# EAGLE design KirmesKontroller (EAGLE 9.6.2)
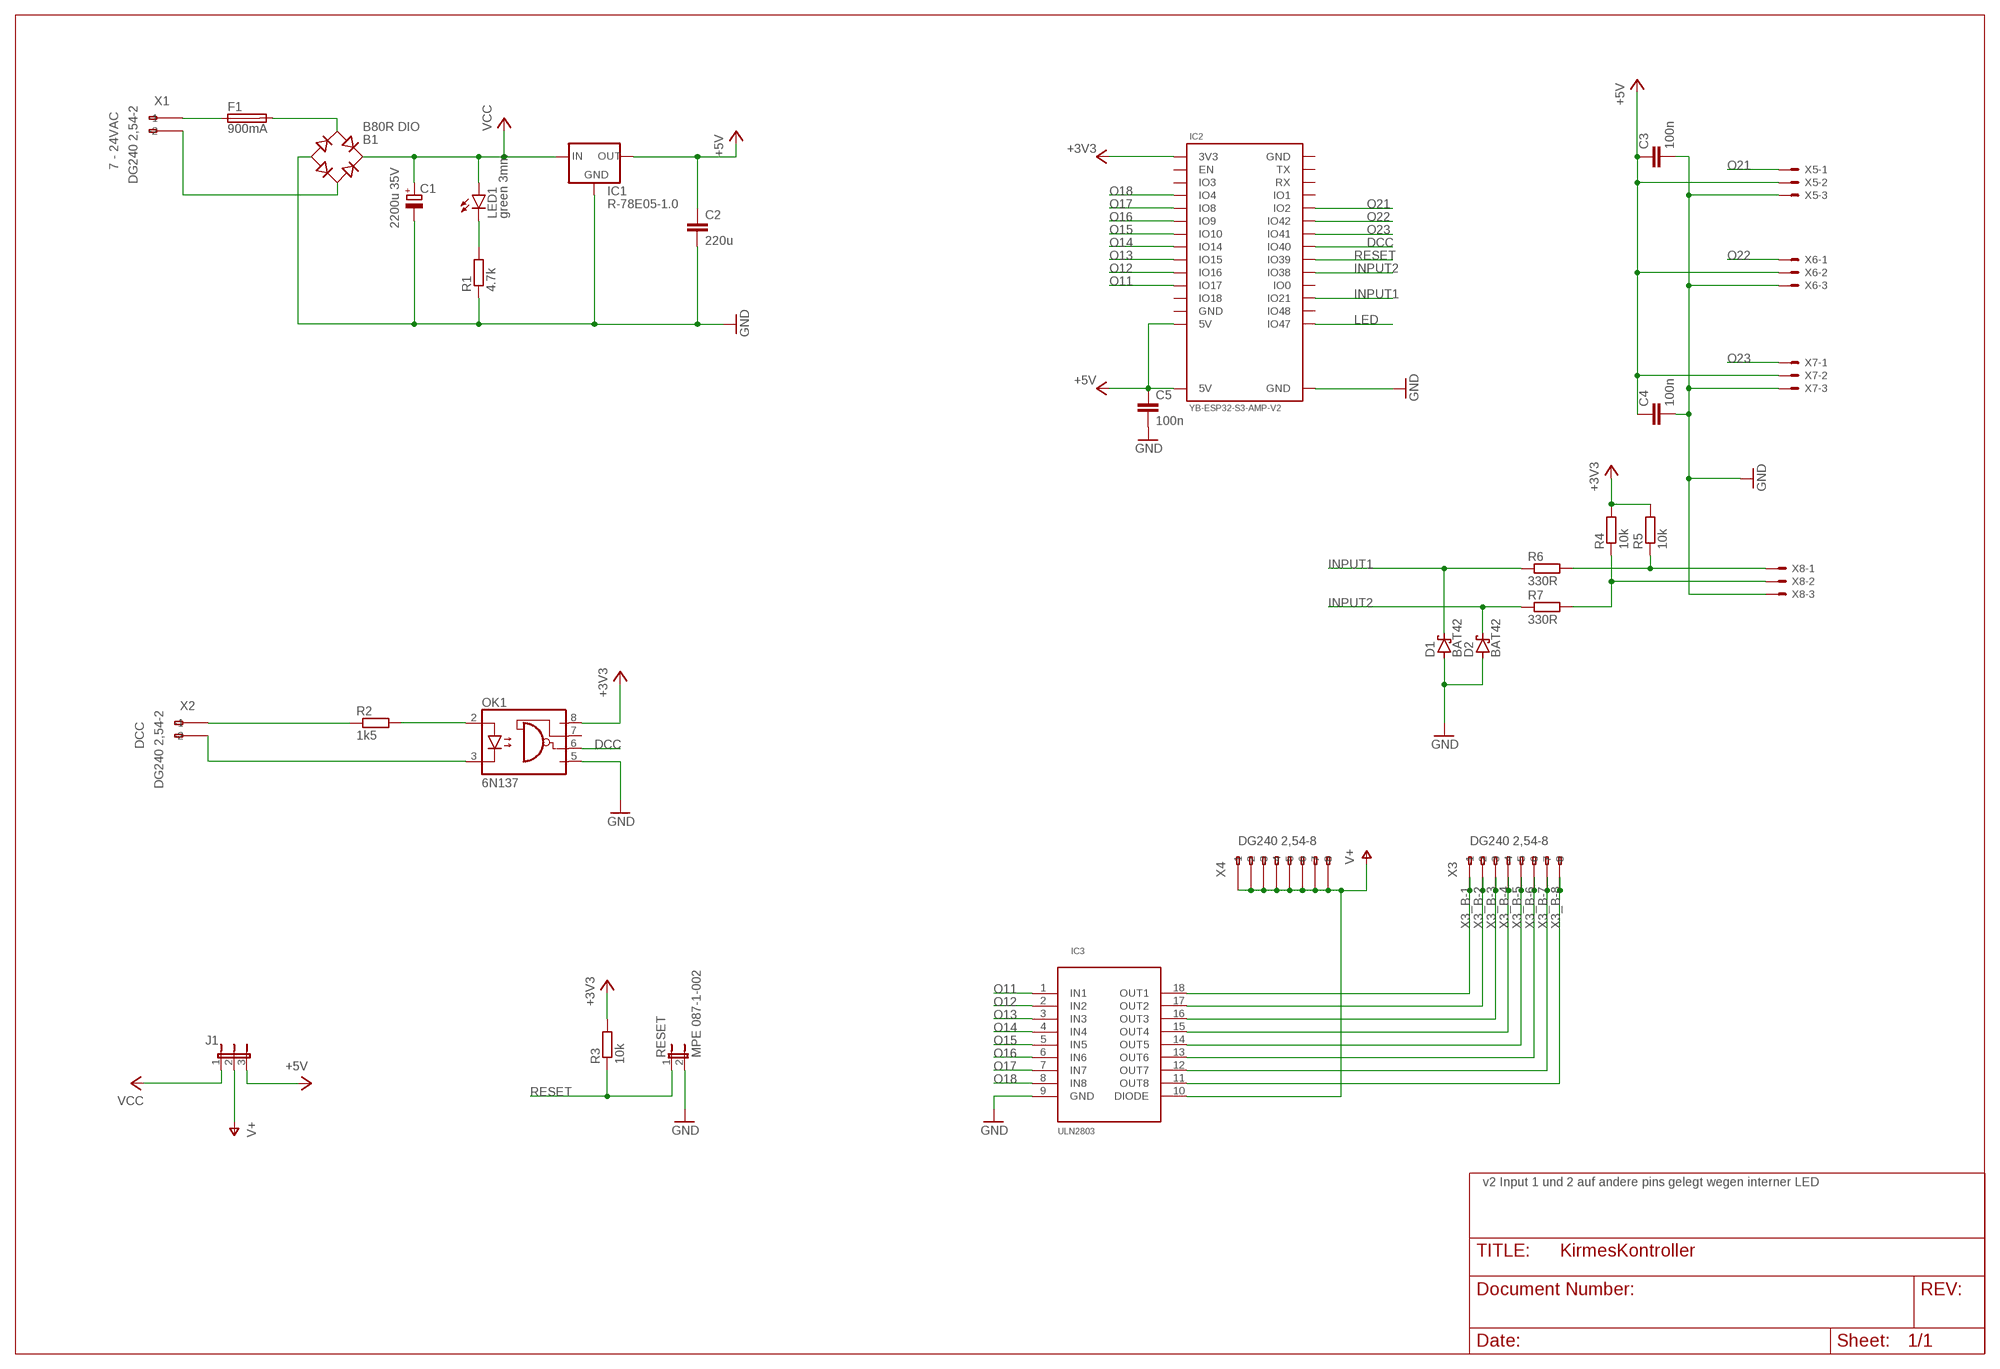
[diagram p0: schematic, sheet 1]

## Parts
B1  B80R DIO  RB1A  [RB1A]
C1  2200u 35V  CPOL-EUE5-8.5  [E5-8,5]
C2  220u  C-EU050-024X044  [C050-024X044]
C3  100n  C-EU050-024X044  [C050-024X044]
C4  100n  C-EU050-024X044  [C050-024X044]
C5  100n  C-EU050-024X044  [C050-024X044]
D1  BAT42  [DO35-10]
D2  BAT42  [DO35-10]
F1  900mA  TE5  [TE5]
IC1  R-78E05-1.0  R-78E-XX1.0  [R-78E-XX1.0]
IC2  YB-ESP32-S3-AMP-V2  [YB-ESP32-S3-AMP]
IC3  ULN2803  ULN2803DIL18  [DIL18]
J1  MPE 087-1-003  JP2E  [JP2]
LED1  green 3mm  TLLG4400  [LED3MM]
OK1  6N137  [DIL08]
R1  4.7k  R-EU_0207/10  [0207/10]
R2  1k5  R-EU_0207/10  [0207/10]
R3  10k  R-EU_0207/10  [0207/10]
R4  10k  R-EU_0207/10  [0207/10]
R5  10k  R-EU_0207/10  [0207/10]
R6  330R  R-EU_0207/10  [0207/10]
R7  330R  R-EU_0207/10  [0207/10]
RESET  MPE 087-1-002  JP1E  [JP1]
X1  DG240 2,54-2  233-202  [233-202]
X2  DG240 2,54-2  233-202  [233-202]
X3  DG240 2,54-8  233-508  [233-508]
X4  DG240 2,54-8  233-508  [233-508]
X5  22-23-2031  [22-23-2031]
X6  22-23-2031  [22-23-2031]
X7  22-23-2031  [22-23-2031]
X8  22-23-2031  [22-23-2031]

## Nets
+3V3: IC2.3V3 OK1.8(VCC) R3.2 R4.2 R5.2
+5V: C2.1 C3.1 C4.1 C5.1 IC1.OUT IC2.5V IC2.5V@1(5V) J1.3 X5.2 X6.2 X7.2
DCC: IC2.40(IO40) OK1.6(VO)
GND: B1.- C1.- C2.2 C3.2 C4.2 C5.2 D1.A D2.A IC1.GND IC2.GND IC3.9(GND) OK1.5(GND) R1.1 RESET.2 X5.3 X6.3 X7.3 X8.3
INPUT1: D1.C IC2.21(IO21) R6.1
INPUT2: D2.C IC2.38(IO38) R7.1
LED: IC2.47(IO47)
N$1: R5.1 R6.2 X8.1
N$2: R4.1 R7.2 X8.2
N$3: LED1.K(C) R1.2
N$5: B1.AC1 F1.2
N$6: B1.AC2 X1.A2(-2)
N$9: R2.1 X2.A1(-1)
N$10: OK1.2(A) R2.2
N$11: OK1.3(C) X2.A2(-2)
N$15: F1.1 X1.A1(-1)
O11: IC2.17(IO17) IC3.1(IN1)
O12: IC2.16(IO16) IC3.2(IN2)
O13: IC2.15(IO15) IC3.3(IN3)
O14: IC2.14(IO14) IC3.4(IN4)
O15: IC2.10(IO10) IC3.5(IN5)
O16: IC2.9(IO9) IC3.6(IN6)
O17: IC2.8(IO8) IC3.7(IN7)
O18: IC2.4(IO4) IC3.8(IN8)
O21: IC2.2(IO2) X5.1
O22: IC2.42(IO42) X6.1
O23: IC2.41(IO41) X7.1
RESET: IC2.39(IO39) R3.1 RESET.1
V+: IC3.10(DIODE) J1.2 X4.A1(-1) X4.A2(-2) X4.A3(-3) X4.A4(-4) X4.A5(-5) X4.A6(-6) X4.A7(-7) X4.A8(-8)
VCC: B1.+ C1.+ IC1.IN J1.1 LED1.A
X3_B-1: IC3.18(OUT1) X3.A1(-1) X3.B1(B-1)
X3_B-2: IC3.17(OUT2) X3.A2(-2) X3.B2(B-2)
X3_B-3: IC3.16(OUT3) X3.A3(-3) X3.B3(B-3)
X3_B-4: IC3.15(OUT4) X3.A4(-4) X3.B4(B-4)
X3_B-5: IC3.14(OUT5) X3.A5(-5) X3.B5(B-5)
X3_B-6: IC3.13(OUT6) X3.A6(-6) X3.B6(B-6)
X3_B-7: IC3.12(OUT7) X3.A7(-7) X3.B7(B-7)
X3_B-8: IC3.11(OUT8) X3.A8(-8) X3.B8(B-8)
Unconnected: IC2.0(IO0) IC2.1(IO1) IC2.3(IO3) IC2.18(IO18) IC2.48(IO48) IC2.EN IC2.RX IC2.TX OK1.7(VE) X1.B1(B-1) X1.B2(B-2) X2.B1(B-1) X2.B2(B-2) X4.B1(B-1) X4.B2(B-2) X4.B3(B-3) X4.B4(B-4) X4.B5(B-5) X4.B6(B-6) X4.B7(B-7) X4.B8(B-8)

## Notes on the sheet
- 7 - 24VAC
- DCC
- v2 Input 1 und 2 auf andere pins gelegt wegen interner LED

## Power pins joined to a net without a drawn wire
GND: IC2.GND@1(GND) IC2.GND@2(GND)

## Library data of the parts
B1 = rectifier:RB1A: RECTIFIER 1 A
C1 = rcl:CPOL-EU: POLARIZED CAPACITOR, European symbol; SPICEPREFIX: C
C2-C5 = rcl:C-EU: CAPACITOR, European symbol; SPICEPREFIX: C
D1 D2 = diode:BAT42: DIODE barrier diode
F1 = fuse:TE5: FUSE Wickmann; OC_FARNELL: unknown; OC_NEWARK: unknown
IC1 = _eigene:R-78E-XX1.0: VOLTAGE REGULATOR
IC2 = yb-esp32-s3-amp:YB-ESP32-S3-AMP: Yellobyte YB-ESP32-S3-AMP (ESP32S3 v2/v3 Audio development board) Source: github.com/yellobyte <https://github.com/yellobyte/ESP32-DevBoards-Getting-Started/tree/main/boards/YB-ESP32-S3-AMP>
IC3 = _eigene:ULN2803
J1 = jumper:JP2E: JUMPER
LED1 = led:TLLG4400: Low Current (2mA) LED 3 mm Tinted Diffused Package color GREEN Source: Data sheet <http://www.farnell.com/datasheets/391098.pdf>; MF: VISHAY SEMICONDUCTOR; OC_FARNELL: 1612435
OK1 = optocoupler:6N137: MOTOROLA OPTO COUPLER; MPN: 6N137; OC_FARNELL: 1328376; OC_NEWARK: 52M1895
R1-R7 = rcl:R-EU_: RESISTOR, European symbol; SPICEPREFIX: R
RESET = jumper:JP1E: JUMPER
X1 X2 = con-wago255:233-202: WAGO; MPN: 233-202; OC_FARNELL: 1283532; OC_NEWARK: 28K9059
X3 X4 = con-wago255:233-508: WAGO; MF: Wago Corporation; MPN: 0233-0508; OC_FARNELL: 1777101; OC_NEWARK: 79K2053
X5-X8 = con-molex:22-23-2031: .100" (2.54mm) Center Header - 3 Pin; MF: MOLEX; MPN: 22-23-2031; OC_FARNELL: 1462950; OC_NEWARK: 30C0862

## Board
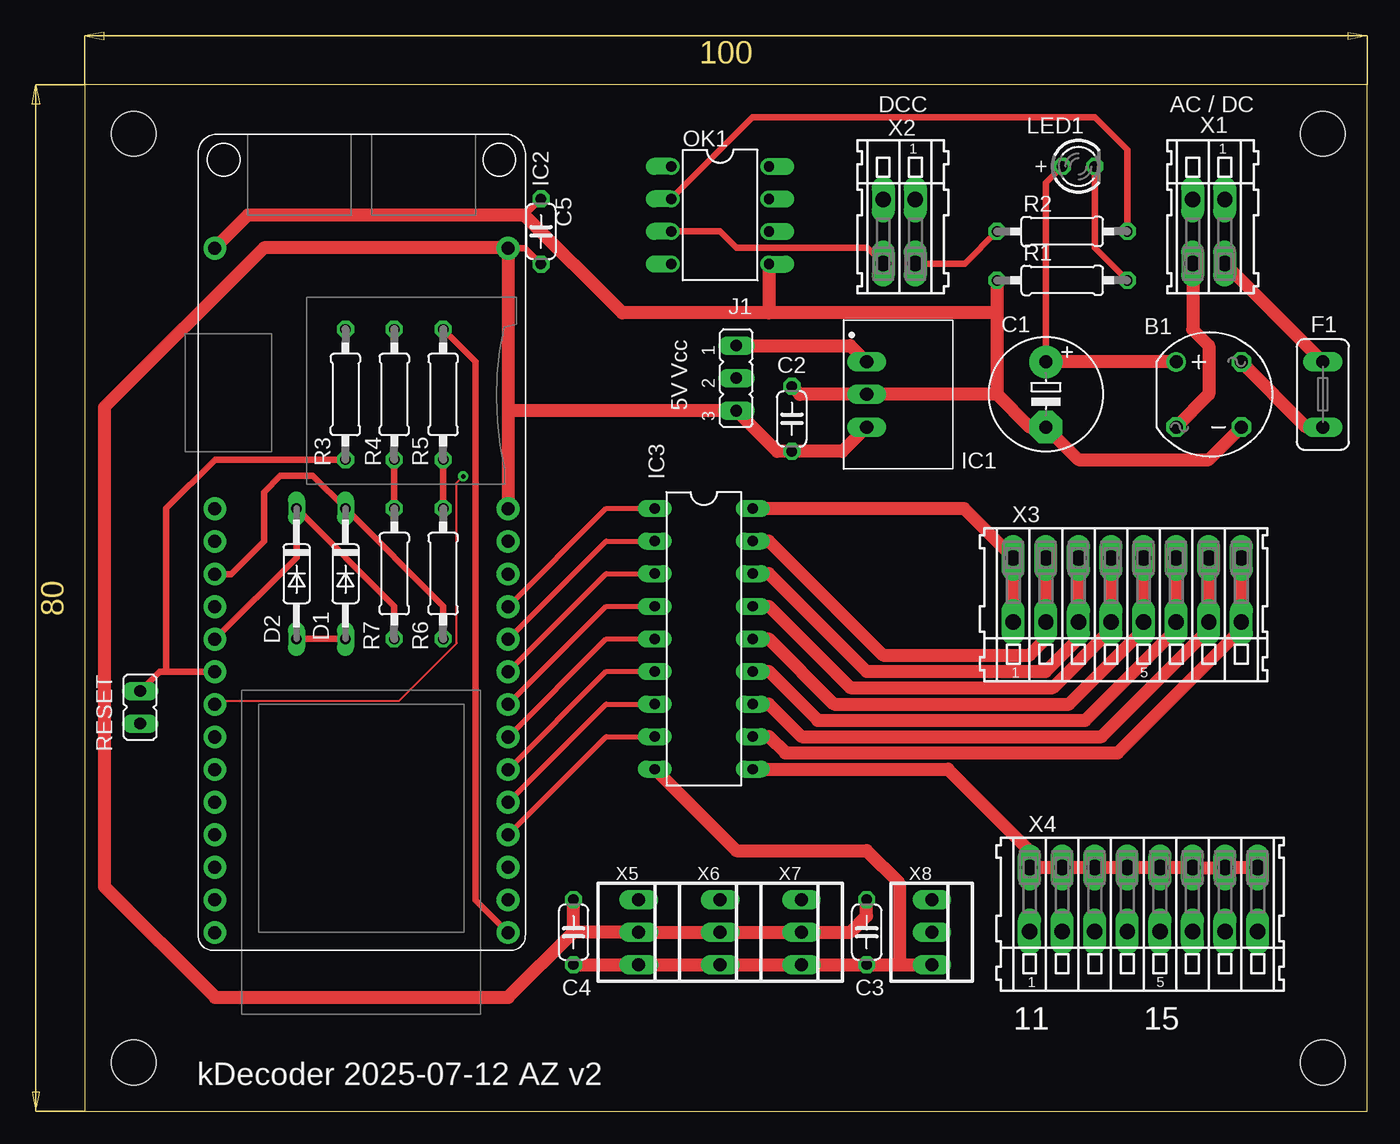
[diagram p1: board, top side]
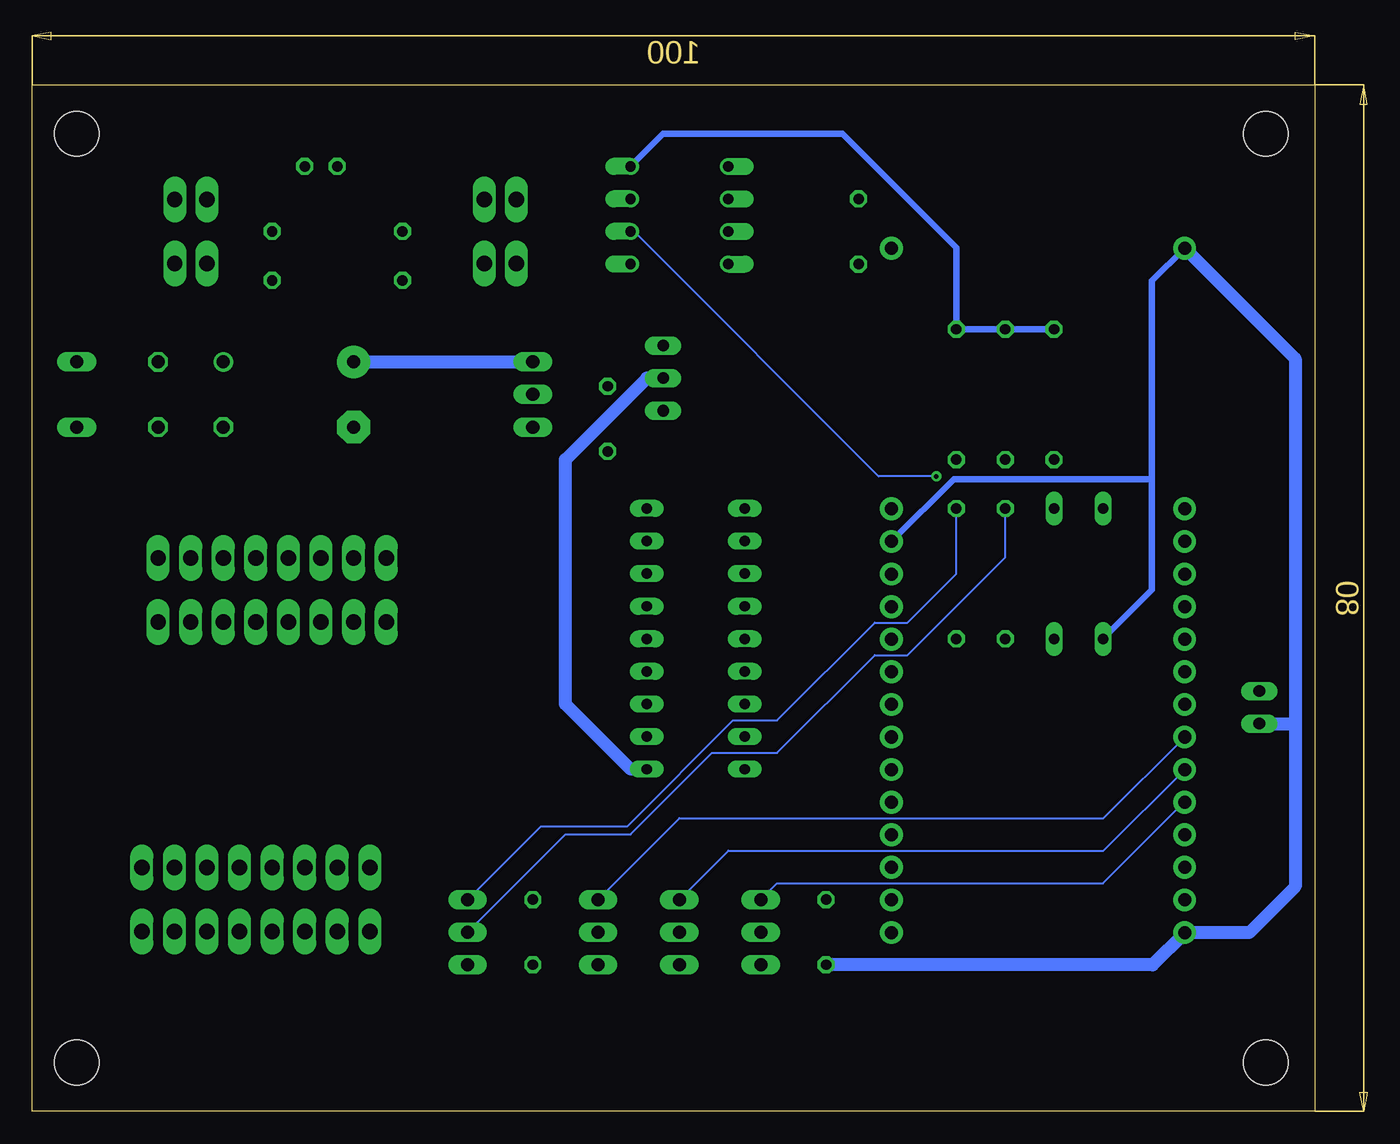
[diagram p2: board, bottom side, seen from below]

Size 100 x 80 mm. Coordinates in mm from the lower left corner, seen from the top.
Outline: 0,0 100,0 100,80 0,80 0,0
Copper layers (1*16): Top 0.035mm / dielectric 1.5mm / Bottom 0.035mm
Design rules "default": minimum track width 6mil, minimum drill 0.35mm, track to track 6mil, track to pad 6mil, pad to pad 6mil, via to via 6mil, smd to smd 6mil, copper to edge 40mil, drill to drill 6mil, minimum pad ring 10mil, minimum via ring 8mil, stop-mask expansion 4mil, vias tented up to drill 0mil, thermal gap 10mil
Holes 3.5 mm at 3.81,76.2 3.81,3.81 96.52,3.81 96.52,76.2

### Footprints (pad centres in the part's own frame; a part is rotated, then mirrored left to right if it is on the bottom)
RB1A = drill 1.016: + -2.54,2.54 | drill 1.016 octagon: - 2.54,-2.54; AC1 2.54,2.54; AC2 -2.54,-2.54
E5-8,5 = drill 1.016 pad 2.54: + -2.54,0 | drill 1.016 pad 2.54 octagon: - 2.54,0
C050-024X044 = drill 0.813 octagon: 1 -2.54,0; 2 2.54,0
DO35-10 = drill 0.813 long: A 5.08,0; C -5.08,0
TE5 = drill 1.016 long: 1 -2.54,0; 2 2.54,0
R-78E-XX1.0 = drill 1.016 long: GND 0,-2.54; IN -2.54,-2.54; OUT 2.54,-2.54
YB-ESP32-S3-AMP = drill 1.016 pad 1.778: 0 27.969,-0.018; 1 45.749,-0.018; 2 43.209,-0.018; 3 48.289,22.843; 3V3 53.369,22.843; 4 45.749,22.843; 5V 0.029,22.843; 5V@1 20.349,22.843; 8 43.209,22.843; 9 40.669,22.843; 10 38.129,22.843; 14 35.589,22.843; 15 33.049,22.843; 16 30.509,22.843; 17 27.969,22.843; 18 25.429,22.843; 21 25.429,-0.018; 38 30.509,-0.018; 39 33.049,-0.018; 40 35.589,-0.018; 41 38.129,-0.018; 42 40.669,-0.018; 47 20.349,-0.018; 48 22.889,-0.018; EN 50.829,22.843; GND 0.029,-0.018; GND@1 53.369,-0.018; GND@2 22.889,22.843; RX 48.289,-0.018; TX 50.829,-0.018
DIL18 = drill 0.813 long: 1 -10.16,-3.81; 2 -7.62,-3.81; 3 -5.08,-3.81; 4 -2.54,-3.81; 5 0,-3.81; 6 2.54,-3.81; 7 5.08,-3.81; 8 7.62,-3.81; 9 10.16,-3.81; 10 10.16,3.81; 11 7.62,3.81; 12 5.08,3.81; 13 2.54,3.81; 14 0,3.81; 15 -2.54,3.81; 16 -5.08,3.81; 17 -7.62,3.81; 18 -10.16,3.81
JP2 = drill 0.914 long: 1 -2.54,0; 2 0,0; 3 2.54,0
LED3MM = drill 0.813 octagon: A -1.27,0; K 1.27,0
DIL08 = drill 0.813 offset: 1 -3.81,-3.81; 2 -1.27,-3.81; 3 1.27,-3.81; 4 3.81,-3.81; 5 3.81,3.81; 6 1.27,3.81; 7 -1.27,3.81; 8 -3.81,3.81
0207/10 = drill 0.813 octagon: 1 -5.08,0; 2 5.08,0
JP1 = drill 0.914 long: 1 0,-1.27; 2 0,1.27
233-202 = drill 1.2 long: A1 -1.25,2.5; A2 1.25,2.5; B1 -1.25,-2.5; B2 1.25,-2.5
233-508 = drill 1.2 long: A1 -8.89,2.5; A2 -6.35,2.5; A3 -3.81,2.5; A4 -1.27,2.5; A5 1.27,2.5; A6 3.81,2.5; A7 6.35,2.5; A8 8.89,2.5; B1 -8.89,-2.5; B2 -6.35,-2.5; B3 -3.81,-2.5; B4 -1.27,-2.5; B5 1.27,-2.5; B6 3.81,-2.5; B7 6.35,-2.5; B8 8.89,-2.5
22-23-2031 = drill 1 long: 1 -2.54,0; 2 0,0; 3 2.54,0

### Placement (x,y rotation side)
B1  87.63,55.88 0 top
C1  74.93,55.88 270 top
C2  55.12,53.98 90 top
C3  60.96,13.97 270 top
C4  38.1,13.97 270 top
C5  35.56,68.58 90 top
D1  20.32,41.91 270 top
D2  16.51,41.91 270 top
F1  96.52,55.88 270 top
IC1  63.5,55.88 270 top
IC2  10.16,67.31 270 top
IC3  48.26,36.83 270 top
J1  50.8,57.15 270 top
LED1  77.47,73.66 0 top
OK1  49.53,69.85 270 top
R1  76.2,64.77 0 top
R2  76.2,68.58 0 top
R3  20.32,55.88 90 top
R4  24.13,55.88 90 top
R5  27.94,55.88 90 top
R6  27.94,41.91 90 top
R7  24.13,41.91 90 top
RESET  4.32,31.5 180 top
X1  87.63,68.58 180 top
X2  63.5,68.58 180 top
X3  81.28,40.64 0 top
X4  82.55,16.51 0 top
X5  43.18,13.97 270 top
X6  49.53,13.97 270 top
X7  55.88,13.97 270 top
X8  66.04,13.97 270 top

### Tracks (layer width: path | path; a pad name or v marks a point on that pad's centre or on a via)
+3V3
  Top 0.508: IC2.3V3 30.48,16.46 30.48,58.42 R5.2
  Bottom 0.508: OK1.8 50.8,76.2 36.83,76.2 27.94,67.31 R5.2 R4.2 R3.2
+5V
  Top 0.508: IC2.5V 34.32,67.28 C5.1
  Top 1.016: IC1.OUT 59.05,51.44 C2.1 53.98,51.44 J1.3 33,54.61 | 38.1,13.97 33.02,8.89 10.16,8.89 1.52,17.53 1.52,54.86 13.97,67.31 32.97,67.31 IC2.5V 33,54.61 | 38.1,13.97 C4.1 | 38.1,13.97 X5.2 X6.2 X7.2 59.69,13.97 60.96,15.24 C3.1 | 33,54.61 IC2.5V@1
DCC  (via drill 0.35)
  Top 0.152: v29.5,49.5 29,49 29,36.5 24.5,32 10.5,32 IC2.40
  Bottom 0.152: v29.5,49.5 34,49.5 53,68.5 OK1.6
GND
  Top 0.508: D2.A D1.A | C5.2 34.29,69.85
  Top 1.016: B1.- 87.63,50.8 77.47,50.8 C1.- 73.66,53.34 71.12,55.88 | 71.12,55.88 IC1.GND 55.75,55.88 C2.2 | R1.1 71.12,62.23 | 71.12,62.23 71.12,55.88 | 71.12,62.23 53.34,62.23 | 53.34,62.23 41.91,62.23 34.29,69.85 12.71,69.85 IC2.GND | C4.2 X5.3 X6.3 X7.3 C3.2 63.5,11.43 | 63.5,11.43 X8.3 | OK1.5 53.34,62.23 | IC3.9 50.8,20.32 60.96,20.32 63.5,17.78 63.5,11.43
  Bottom 0.508: D2.A 12.7,40.64 12.7,49.28 | IC2.GND 12.7,64.72 12.7,49.28 | IC2.GND@2 28.15,49.28 12.7,49.28
  Bottom 1.016: IC2.GND 1.52,58.66 1.52,30.48 | 1.52,30.48 1.52,17.53 5.11,13.94 IC2.GND@1 12.65,11.43 C4.2 | RESET.2 1.78,30.23 1.52,30.48
INPUT1
  Top 0.508: R6.1 27.94,39.37 D1.C 17.78,49.53 15.24,49.53 13.97,48.26 13.97,44.45 11.4,41.88 IC2.21
INPUT2
  Top 0.508: R7.1 24.13,39.37 D2.C 16.51,43.17 IC2.38
N$1
  Top 0.508: R6.2 R5.1
  Bottom 0.152: X8.1 60.33,22.23 53.59,22.23 45.34,30.48 41.91,30.48 34.29,38.1 31.75,38.1 27.94,41.91 R6.2
N$2
  Top 0.508: R4.1 R7.2
  Bottom 0.152: X8.2 58.42,21.59 53.34,21.59 46.99,27.94 41.91,27.94 34.29,35.56 31.75,35.56 24.13,43.18 R7.2
N$3
  Top 0.508: LED1.K 78.74,67.31 R1.2
N$5
  Top 1.016: B1.AC1 95.25,53.34 F1.2
N$6
  Top 1.016: X1.A2 86.38,60.94 87.63,59.69 87.63,55.88 B1.AC2
N$9
  Top 0.508: X2.A1 68.62,66.08 R2.1
N$10
  Top 0.508: R2.2 81.28,74.93 78.74,77.47 52.07,77.47 OK1.2
N$11
  Top 0.508: OK1.3 49.53,68.58 50.8,67.31 61.02,67.31 X2.A2
N$15
  Top 1.016: X1.A1 96.52,58.44 F1.1
O11
  Top 0.406: IC2.17 40.65,46.99 IC3.1
O12
  Top 0.406: IC2.16 40.65,44.45 IC3.2
O13
  Top 0.406: IC2.15 40.65,41.91 IC3.3
O14
  Top 0.406: IC2.14 40.65,39.37 IC3.4
O15
  Top 0.406: IC2.10 40.65,36.83 IC3.5
O16
  Top 0.406: IC2.9 40.65,34.29 IC3.6
O17
  Top 0.406: IC2.8 40.65,31.75 IC3.7
O18
  Top 0.406: IC2.4 40.65,29.21 IC3.8
O21
  Bottom 0.152: IC2.2 10.21,24.08 16.51,17.78 41.91,17.78 X5.1
O22
  Bottom 0.152: X6.1 45.72,20.32 16.46,20.32 IC2.42
O23
  Bottom 0.152: X7.1 49.53,22.86 16.46,22.86 IC2.41
RESET
  Top 0.152: 10.17,34.27 IC2.39
  Top 0.508: RESET.1 5.82,34.27 6.35,34.27 | 6.35,34.27 10.17,34.27 | R3.1 10.16,50.8 6.35,46.99 6.35,34.27
V+
  Top 1.016: X4.A8 88.94,19.01 | 88.94,19.01 88.9,19.05 X4.A7 | 88.94,19.01 X4.A6 X4.A5 X4.A4 X4.A3 X4.A2 X4.A1 73.66,20.32 67.31,26.67 IC3.10
  Bottom 1.016: IC3.10 53.34,26.67 58.42,31.75 58.42,50.8 52.07,57.15 J1.2
VCC
  Top 0.508: C1.+ 74.93,72.39 LED1.A
  Top 1.016: B1.+ C1.+ | J1.1 59.69,59.69 IC1.IN
  Bottom 1.016: C1.+ IC1.IN
X3_B-1
  Top 1.016: IC3.18 68.54,46.99 X3.A1 X3.B1
X3_B-2
  Top 1.016: IC3.17 53.34,44.45 62.23,35.56 73.66,35.56 74.93,36.83 X3.B2 X3.A2
X3_B-3
  Top 1.016: IC3.16 53.34,41.91 60.96,34.29 74.93,34.29 77.47,36.83 X3.B3 X3.A3
X3_B-4
  Top 1.016: IC3.15 53.34,39.37 59.69,33.02 75.46,33.02 80.01,37.57 X3.B4 X3.A4
X3_B-5
  Top 1.016: IC3.14 53.34,36.83 58.42,31.75 76.73,31.75 82.55,37.57 X3.B5 X3.A5
X3_B-6
  Top 1.016: IC3.13 53.34,34.29 57.15,30.48 78,30.48 85.09,37.57 X3.B6 X3.A6
X3_B-7
  Top 1.016: IC3.12 53.34,31.75 55.88,29.21 79.27,29.21 87.63,37.57 X3.B7 X3.A7
X3_B-8
  Top 1.016: IC3.11 53.34,29.21 54.61,27.94 80.54,27.94 90.17,37.57 X3.B8 X3.A8

### Text on the board
tNames: DCC | AC / DC | + | Vcc | 5V | 11 | 15 | kDecoder 2025-07-12 AZ v2